# Altium schematic sheet LED_low_side_connector.SchDoc: LED Low Power Connector
size B; SheetNumber: 7; SheetTotal: 14
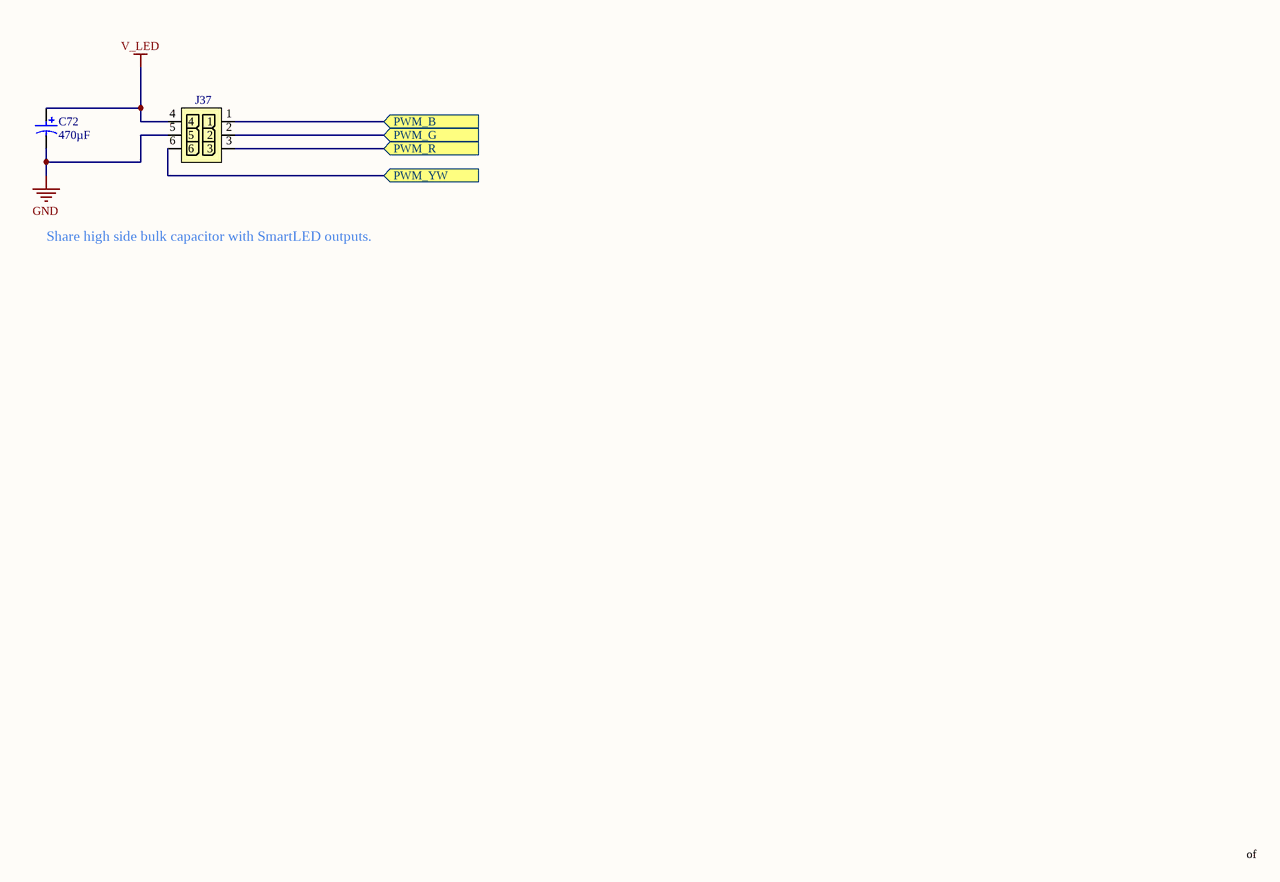
[diagram p0: LED_low_side_connector.SchDoc]

## Parts
C72  value 470µF  [CAP_POL_DIAM10_H22_SPACING5]  (hidden comment: REH1020471M050K)
J37  212528-0600  [212528-0600-Footprint-1]  (value not drawn)

## Ports
PWM_B (in), PWM_G (in), PWM_R (in), PWM_YW (in)

## Nets
GND: C72.2 J37.5
V_LED: C72.1 J37.4
PWM_B: J37.1 ; port PWM_B
PWM_G: J37.2 ; port PWM_G
PWM_R: J37.3 ; port PWM_R
PWM_YW: J37.6 ; port PWM_YW

## Notes on the sheet
- Share high side bulk capacitor with SmartLED outputs.
- of

## Library data of the parts
C72 = CMP-001-00166-1: CAP ALUM 470UF 20% 50V RADIAL TH; Capacitor Type: Aluminium; RoHS Compliant: Yes; Case/Package: Radial; Tolerance: 20%; Voltage Rating: 50V; Min Operating Temperature: 125°C; Max Operating Temperature: -40°C; Mounting Technology: Through Hole; Pins: 2
J37 = CMP-002-00218-3: Connector, Micro-Fit+ Right Angle 6ckt Header - Tin; Gender: Male; Max Current Rating: 12.5A; Mounting Technology: Through Hole; Pins: 6; Connector Type: Micro-Fit+